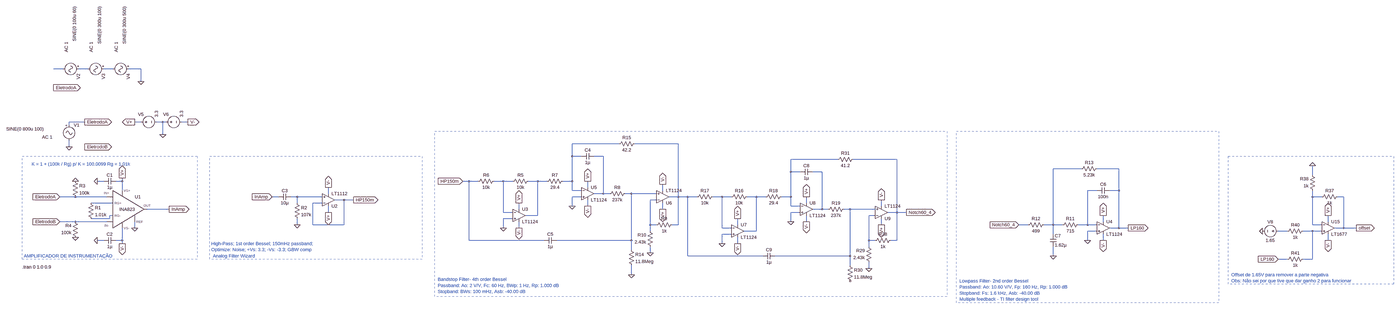
[diagram p0: schematic canal_4th_order.asc, whole sheet]
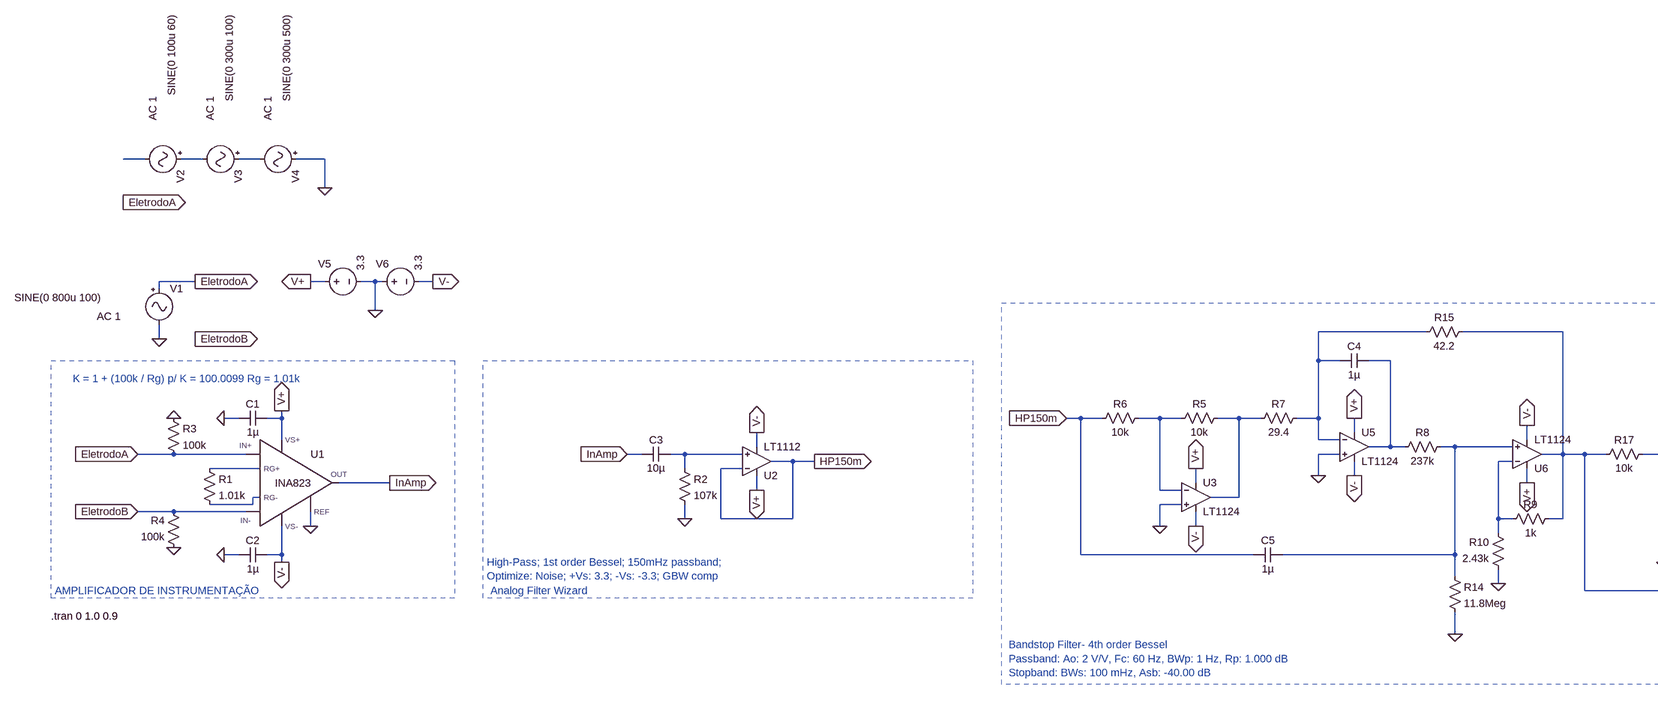
[diagram p1: schematic canal_4th_order.asc, part, row 1 of 1, column 1 of 2]
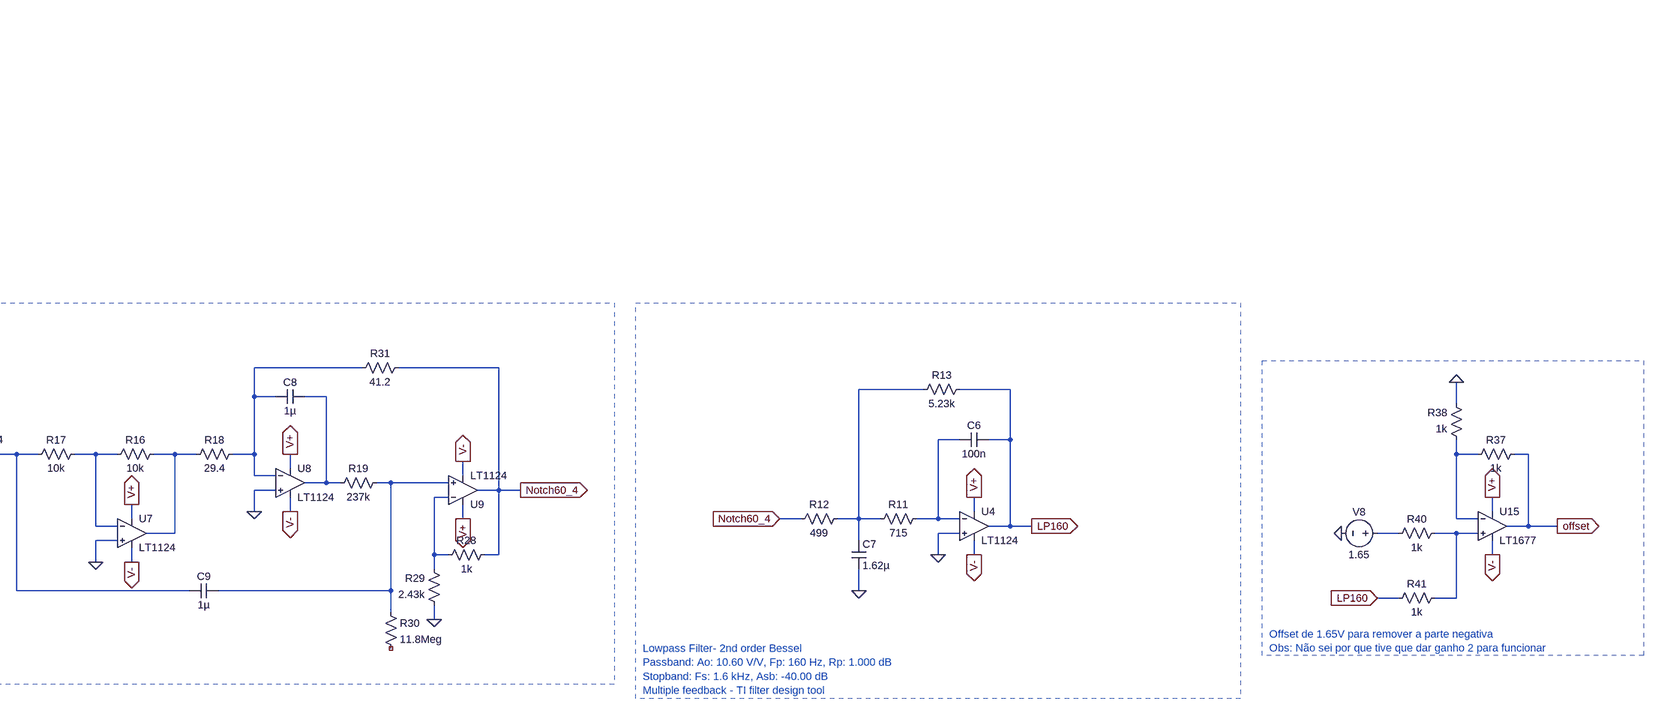
[diagram p2: schematic canal_4th_order.asc, part, row 1 of 1, column 2 of 2]
canal_4th_order.asc, the LTspice schematic file:
Version 4
SHEET 1 6804 2324
WIRE -688 -592 -736 -592
WIRE -560 -592 -608 -592
WIRE -432 -592 -480 -592
WIRE -288 -592 -352 -592
WIRE -288 -528 -288 -592
WIRE -576 -320 -656 -320
WIRE -288 -320 -320 -320
WIRE -176 -320 -208 -320
WIRE -160 -320 -176 -320
WIRE -48 -320 -80 -320
WIRE -656 -304 -656 -320
WIRE -176 -256 -176 -320
WIRE 2160 -208 1920 -208
WIRE 2464 -208 2240 -208
WIRE -656 -192 -656 -224
WIRE 1920 -144 1920 -208
WIRE 1968 -144 1920 -144
WIRE 2080 -144 2032 -144
WIRE 3280 -128 3040 -128
WIRE 3584 -128 3360 -128
WIRE 4528 -80 4384 -80
WIRE 4720 -80 4608 -80
WIRE 3040 -64 3040 -128
WIRE 3088 -64 3040 -64
WIRE 3200 -64 3152 -64
WIRE 5712 -48 5712 -96
WIRE -480 -16 -512 -16
WIRE -384 -16 -384 -32
WIRE -384 -16 -416 -16
WIRE 1392 -16 1360 -16
WIRE 1440 -16 1392 -16
WIRE 1568 -16 1520 -16
WIRE 1616 -16 1568 -16
WIRE 1744 -16 1696 -16
WIRE 1792 -16 1744 -16
WIRE 1920 -16 1920 -144
WIRE 1920 -16 1872 -16
WIRE 2000 16 2000 -16
WIRE -384 32 -384 -16
WIRE 1920 32 1920 -16
WIRE 1968 32 1920 32
WIRE 2384 32 2384 0
WIRE 4608 32 4560 32
WIRE 4720 32 4720 -80
WIRE 4720 32 4672 32
WIRE 672 48 672 16
WIRE 2080 48 2080 -144
WIRE 2080 48 2032 48
WIRE 2112 48 2080 48
WIRE 2224 48 2192 48
WIRE 2352 48 2224 48
WIRE -624 64 -704 64
WIRE -464 64 -624 64
WIRE 416 64 384 64
WIRE 512 64 480 64
WIRE 640 64 512 64
WIRE 1968 64 1920 64
WIRE 2464 64 2464 -208
WIRE 2464 64 2416 64
WIRE 2512 64 2464 64
WIRE 2560 64 2512 64
WIRE 2688 64 2640 64
WIRE 2736 64 2688 64
WIRE 2864 64 2816 64
WIRE 2912 64 2864 64
WIRE 3040 64 3040 -64
WIRE 3040 64 2992 64
WIRE 5712 64 5712 32
WIRE 5760 64 5712 64
WIRE 5872 64 5840 64
WIRE 752 80 704 80
WIRE 800 80 752 80
WIRE 2352 80 2320 80
WIRE -432 96 -544 96
WIRE 512 96 512 64
WIRE 640 96 592 96
WIRE 3120 96 3120 64
WIRE 1920 112 1920 64
WIRE 2000 112 2000 80
WIRE 3040 112 3040 64
WIRE 3088 112 3040 112
WIRE 3504 112 3504 80
WIRE -144 128 -256 128
WIRE 1648 128 1648 96
WIRE 2384 128 2384 96
WIRE 3200 128 3200 -64
WIRE 3200 128 3152 128
WIRE 3232 128 3200 128
WIRE 3344 128 3312 128
WIRE 3472 128 3344 128
WIRE 672 144 672 112
WIRE 1568 144 1568 -16
WIRE 1616 144 1568 144
WIRE 3088 144 3040 144
WIRE 3584 144 3584 -128
WIRE 3584 144 3536 144
WIRE 3632 144 3584 144
WIRE -432 160 -448 160
WIRE 1744 160 1744 -16
WIRE 1744 160 1680 160
WIRE 3472 160 3440 160
WIRE -448 176 -448 160
WIRE -448 176 -544 176
WIRE 1616 176 1568 176
WIRE -624 192 -704 192
WIRE -464 192 -624 192
WIRE 3040 192 3040 144
WIRE 3120 192 3120 160
WIRE 4640 192 4640 160
WIRE 5792 192 5792 160
WIRE 512 208 512 176
WIRE 592 208 592 96
WIRE 752 208 752 80
WIRE 752 208 592 208
WIRE 2320 208 2320 80
WIRE 2352 208 2320 208
WIRE 2464 208 2464 64
WIRE 2464 208 2432 208
WIRE 2768 208 2768 176
WIRE 3504 208 3504 176
WIRE 4256 208 4208 208
WIRE 4384 208 4384 -80
WIRE 4384 208 4336 208
WIRE 4432 208 4384 208
WIRE 4560 208 4560 32
WIRE 4560 208 4512 208
WIRE 4608 208 4560 208
WIRE 5712 208 5712 64
WIRE 5760 208 5712 208
WIRE -320 224 -320 192
WIRE 1568 224 1568 176
WIRE 1648 224 1648 192
WIRE 2688 224 2688 64
WIRE 2736 224 2688 224
WIRE 4720 224 4720 32
WIRE 4720 224 4672 224
WIRE 4768 224 4720 224
WIRE 5872 224 5872 64
WIRE 5872 224 5824 224
WIRE 5936 224 5872 224
WIRE 2320 240 2320 208
WIRE 2864 240 2864 64
WIRE 2864 240 2800 240
WIRE 4608 240 4560 240
WIRE 5584 240 5536 240
WIRE 5712 240 5664 240
WIRE 5760 240 5712 240
WIRE 2736 256 2688 256
WIRE 4384 256 4384 208
WIRE -480 288 -512 288
WIRE -384 288 -384 224
WIRE -384 288 -416 288
WIRE 1392 288 1392 -16
WIRE 1776 288 1392 288
WIRE 2224 288 2224 48
WIRE 2224 288 1840 288
WIRE 3440 288 3440 160
WIRE 3472 288 3440 288
WIRE 3584 288 3584 144
WIRE 3584 288 3552 288
WIRE 4560 288 4560 240
WIRE 4640 288 4640 256
WIRE 5792 288 5792 256
WIRE -384 304 -384 288
WIRE 2688 304 2688 256
WIRE 2768 304 2768 272
WIRE 3440 320 3440 288
WIRE 2224 336 2224 288
WIRE 2320 352 2320 320
WIRE 2512 368 2512 64
WIRE 2896 368 2512 368
WIRE 3344 368 3344 128
WIRE 3344 368 2960 368
WIRE 4384 368 4384 320
WIRE 5584 384 5536 384
WIRE 5712 384 5712 240
WIRE 5712 384 5664 384
WIRE 3344 416 3344 368
WIRE 3440 432 3440 400
WIRE 2224 464 2224 416
FLAG -624 -16 0
FLAG -624 272 0
FLAG -576 -192 EletrodoB
IOPIN -576 -192 Out
FLAG -704 64 EletrodoA
IOPIN -704 64 In
FLAG -704 192 EletrodoB
IOPIN -704 192 In
FLAG -144 128 InAmp
IOPIN -144 128 Out
FLAG -176 -256 0
FLAG -320 -320 V+
IOPIN -320 -320 Out
FLAG -48 -320 V-
IOPIN -48 -320 Out
FLAG -384 304 V-
IOPIN -384 304 Out
FLAG -384 -32 V+
IOPIN -384 -32 Out
FLAG -320 224 0
FLAG -512 -16 0
FLAG -512 288 0
FLAG -656 -192 0
FLAG 672 144 V+
IOPIN 672 144 Out
FLAG 672 16 V-
IOPIN 672 16 Out
FLAG 512 208 0
FLAG 384 64 InAmp
IOPIN 384 64 In
FLAG 800 80 HP150m
IOPIN 800 80 Out
FLAG -576 -320 EletrodoA
IOPIN -576 -320 Out
FLAG 4640 160 V+
IOPIN 4640 160 Out
FLAG 4640 288 V-
IOPIN 4640 288 Out
FLAG 4384 368 0
FLAG 4208 208 Notch60_4
IOPIN 4208 208 In
FLAG 4560 288 0
FLAG 4768 224 LP160
IOPIN 4768 224 Out
FLAG -288 -528 0
FLAG -736 -496 EletrodoA
IOPIN -736 -496 Out
FLAG 1568 224 0
FLAG 1648 96 V+
IOPIN 1648 96 Out
FLAG 1648 224 V-
IOPIN 1648 224 Out
FLAG 2000 -16 V+
IOPIN 2000 -16 Out
FLAG 2000 112 V-
IOPIN 2000 112 Out
FLAG 1920 112 0
FLAG 2384 128 V+
IOPIN 2384 128 Out
FLAG 2384 0 V-
IOPIN 2384 0 Out
FLAG 2320 352 0
FLAG 2224 464 0
FLAG 1360 -16 HP150m
IOPIN 1360 -16 In
FLAG 2688 304 0
FLAG 2768 176 V+
IOPIN 2768 176 Out
FLAG 2768 304 V-
IOPIN 2768 304 Out
FLAG 3120 64 V+
IOPIN 3120 64 Out
FLAG 3120 192 V-
IOPIN 3120 192 Out
FLAG 3040 192 0
FLAG 3504 208 V+
IOPIN 3504 208 Out
FLAG 3504 80 V-
IOPIN 3504 80 Out
FLAG 3440 432 0
FLAG 3632 144 Notch60_4
IOPIN 3632 144 Out
FLAG 5792 288 V-
IOPIN 5792 288 Out
FLAG 5792 160 V+
IOPIN 5792 160 Out
FLAG 5456 240 0
FLAG 5536 384 LP160
IOPIN 5536 384 In
FLAG 5712 -96 0
FLAG 5936 224 offset
IOPIN 5936 224 Out
SYMBOL INA823 -368 128 R0
SYMATTR InstName U1
SYMBOL res -640 -32 R0
SYMATTR InstName R3
SYMATTR Value 100k
SYMBOL res -608 288 R180
WINDOW 0 36 76 Left 2
WINDOW 3 36 40 Left 2
SYMATTR InstName R4
SYMATTR Value 100k
SYMBOL voltage -304 -320 R270
WINDOW 123 0 0 Left 0
WINDOW 39 0 0 Left 0
WINDOW 0 39 1 VRight 2
SYMATTR InstName V5
SYMATTR Value 3.3
SYMBOL voltage -176 -320 R270
WINDOW 123 0 0 Left 0
WINDOW 39 0 0 Left 0
WINDOW 0 39 1 VRight 2
SYMATTR InstName V6
SYMATTR Value 3.3
SYMBOL cap -416 -32 R90
WINDOW 0 0 32 VBottom 2
WINDOW 3 32 32 VTop 2
SYMATTR InstName C1
SYMATTR Value 1µ
SYMBOL cap -416 272 R90
WINDOW 0 0 32 VBottom 2
WINDOW 3 32 32 VTop 2
SYMATTR InstName C2
SYMATTR Value 1µ
SYMBOL res -560 80 R0
SYMATTR InstName R1
SYMATTR Value 1.01k
SYMBOL Misc\\signal -656 -320 R0
WINDOW 3 -322 36 Left 2
WINDOW 123 -139 78 Left 2
WINDOW 39 0 0 Left 0
SYMATTR Value SINE(0 800u 100)
SYMATTR Value2 AC 1
SYMATTR InstName V1
SYMBOL OpAmps\\LT1112 672 144 M180
SYMATTR InstName U2
SYMBOL res 496 80 R0
SYMATTR InstName R2
SYMATTR Value 107k
SYMBOL cap 480 48 R90
WINDOW 0 0 32 VBottom 2
WINDOW 3 32 32 VTop 2
SYMATTR InstName C3
SYMATTR Value 10µ
SYMBOL OpAmps\\LT1124 4640 160 R0
SYMATTR InstName U4
SYMBOL cap 4672 16 R90
WINDOW 0 0 32 VBottom 2
WINDOW 3 32 32 VTop 2
SYMATTR InstName C6
SYMATTR Value 100n
SYMBOL res 4528 192 R90
WINDOW 0 0 56 VBottom 2
WINDOW 3 32 56 VTop 2
SYMATTR InstName R11
SYMATTR Value 715
SYMBOL cap 4368 256 R0
SYMATTR InstName C7
SYMATTR Value 1.62µ
SYMBOL res 4352 192 R90
WINDOW 0 0 56 VBottom 2
WINDOW 3 32 56 VTop 2
SYMATTR InstName R12
SYMATTR Value 499
SYMBOL res 4624 -96 R90
WINDOW 0 0 56 VBottom 2
WINDOW 3 32 56 VTop 2
SYMATTR InstName R13
SYMATTR Value 5.23k
SYMBOL Misc\\signal -592 -592 R90
WINDOW 3 -322 36 Left 2
WINDOW 123 -139 78 Left 2
WINDOW 39 0 0 Left 0
SYMATTR Value SINE(0 100u 60)
SYMATTR Value2 AC 1
SYMATTR InstName V2
SYMBOL Misc\\signal -464 -592 R90
WINDOW 3 -322 36 Left 2
WINDOW 123 -139 78 Left 2
WINDOW 39 0 0 Left 0
SYMATTR Value SINE(0 300u 100)
SYMATTR Value2 AC 1
SYMATTR InstName V3
SYMBOL Misc\\signal -336 -592 R90
WINDOW 3 -322 36 Left 2
WINDOW 123 -139 78 Left 2
WINDOW 39 0 0 Left 0
SYMATTR Value SINE(0 300u 500)
SYMATTR Value2 AC 1
SYMATTR InstName V4
SYMBOL res 1712 -32 R90
WINDOW 0 0 56 VBottom 2
WINDOW 3 32 56 VTop 2
SYMATTR InstName R5
SYMATTR Value 10k
SYMBOL res 1536 -32 R90
WINDOW 0 0 56 VBottom 2
WINDOW 3 32 56 VTop 2
SYMATTR InstName R6
SYMATTR Value 10k
SYMBOL OpAmps\\LT1124 1648 96 R0
SYMATTR InstName U3
SYMBOL res 1888 -32 R90
WINDOW 0 0 56 VBottom 2
WINDOW 3 32 56 VTop 2
SYMATTR InstName R7
SYMATTR Value 29.4
SYMBOL OpAmps\\LT1124 2000 -16 R0
SYMATTR InstName U5
SYMBOL cap 2032 -160 R90
WINDOW 0 0 32 VBottom 2
WINDOW 3 32 32 VTop 2
SYMATTR InstName C4
SYMATTR Value 1µ
SYMBOL res 2208 32 R90
WINDOW 0 0 56 VBottom 2
WINDOW 3 32 56 VTop 2
SYMATTR InstName R8
SYMATTR Value 237k
SYMBOL cap 1840 272 R90
WINDOW 0 0 32 VBottom 2
WINDOW 3 32 32 VTop 2
SYMATTR InstName C5
SYMATTR Value 1µ
SYMBOL OpAmps\\LT1124 2384 128 M180
SYMATTR InstName U6
SYMBOL res 2448 192 R90
WINDOW 0 0 56 VBottom 2
WINDOW 3 32 56 VTop 2
SYMATTR InstName R9
SYMATTR Value 1k
SYMBOL res 2336 336 R180
WINDOW 0 36 76 Left 2
WINDOW 3 36 40 Left 2
SYMATTR InstName R10
SYMATTR Value 2.43k
SYMBOL res 2208 320 R0
SYMATTR InstName R14
SYMATTR Value 11.8Meg
SYMBOL res 2256 -224 R90
WINDOW 0 0 56 VBottom 2
WINDOW 3 32 56 VTop 2
SYMATTR InstName R15
SYMATTR Value 42.2
SYMBOL res 2832 48 R90
WINDOW 0 0 56 VBottom 2
WINDOW 3 32 56 VTop 2
SYMATTR InstName R16
SYMATTR Value 10k
SYMBOL res 2656 48 R90
WINDOW 0 0 56 VBottom 2
WINDOW 3 32 56 VTop 2
SYMATTR InstName R17
SYMATTR Value 10k
SYMBOL OpAmps\\LT1124 2768 176 R0
SYMATTR InstName U7
SYMBOL res 3008 48 R90
WINDOW 0 0 56 VBottom 2
WINDOW 3 32 56 VTop 2
SYMATTR InstName R18
SYMATTR Value 29.4
SYMBOL OpAmps\\LT1124 3120 64 R0
SYMATTR InstName U8
SYMBOL cap 3152 -80 R90
WINDOW 0 0 32 VBottom 2
WINDOW 3 32 32 VTop 2
SYMATTR InstName C8
SYMATTR Value 1µ
SYMBOL res 3328 112 R90
WINDOW 0 0 56 VBottom 2
WINDOW 3 32 56 VTop 2
SYMATTR InstName R19
SYMATTR Value 237k
SYMBOL cap 2960 352 R90
WINDOW 0 0 32 VBottom 2
WINDOW 3 32 32 VTop 2
SYMATTR InstName C9
SYMATTR Value 1µ
SYMBOL OpAmps\\LT1124 3504 208 M180
SYMATTR InstName U9
SYMBOL res 3568 272 R90
WINDOW 0 0 56 VBottom 2
WINDOW 3 32 56 VTop 2
SYMATTR InstName R28
SYMATTR Value 1k
SYMBOL res 3456 416 R180
WINDOW 0 36 76 Left 2
WINDOW 3 36 40 Left 2
SYMATTR InstName R29
SYMATTR Value 2.43k
SYMBOL res 3328 400 R0
SYMATTR InstName R30
SYMATTR Value 11.8Meg
SYMBOL res 3376 -144 R90
WINDOW 0 0 56 VBottom 2
WINDOW 3 32 56 VTop 2
SYMATTR InstName R31
SYMATTR Value 41.2
SYMBOL OpAmps\\LT1677 5792 160 R0
SYMATTR InstName U15
SYMBOL res 5680 224 R90
WINDOW 0 0 56 VBottom 2
WINDOW 3 32 56 VTop 2
SYMATTR InstName R40
SYMATTR Value 1k
SYMBOL res 5680 368 R90
WINDOW 0 0 56 VBottom 2
WINDOW 3 32 56 VTop 2
SYMATTR InstName R41
SYMATTR Value 1k
SYMBOL voltage 5552 240 R90
WINDOW 0 -32 56 VBottom 2
WINDOW 3 32 56 VTop 2
WINDOW 123 0 0 Left 0
WINDOW 39 0 0 Left 0
SYMATTR InstName V8
SYMATTR Value 1.65
SYMBOL res 5856 48 R90
WINDOW 0 0 56 VBottom 2
WINDOW 3 32 56 VTop 2
SYMATTR InstName R37
SYMATTR Value 1k
SYMBOL res 5728 48 R180
WINDOW 0 36 76 Left 2
WINDOW 3 36 40 Left 2
SYMATTR InstName R38
SYMATTR Value 1k
TEXT -848 -104 Left 2 ;K = 1 + (100k / Rg) p/ K = 100.0099 Rg = 1.01k
TEXT -888 368 Left 2 ;AMPLIFICADOR DE INSTRUMENTAÇÃO
TEXT -896 424 Left 2 !.tran 0 1.0 0.9
TEXT 72 304 Left 2 ;High-Pass; 1st order Bessel; 150mHz passband; \nOptimize: Noise; +Vs: 3.3; -Vs: -3.3; GBW comp
TEXT 80 368 Left 2 ;Analog Filter Wizard
TEXT 3904 496 Left 2 ;Lowpass Filter- 2nd order Bessel\nPassband: Ao: 10.60 V/V, Fp: 160 Hz, Rp: 1.000 dB\nStopband: Fs: 1.6 kHz, Asb: -40.00 dB\nMultiple feedback - TI filter design tool
TEXT 1232 488 Left 2 ;Bandstop Filter- 4th order Bessel\nPassband: Ao: 2 V/V, Fc: 60 Hz, BWp: 1 Hz, Rp: 1.000 dB\nStopband: BWs: 100 mHz, Asb: -40.00 dB
TEXT 5296 464 Left 2 ;Offset de 1.65V para remover a parte negativa\nObs: Não sei por que tive que dar ganho 2 para funcionar
RECTANGLE Normal 0 384 -896 -144 2
RECTANGLE Normal 1152 384 64 -144 2
RECTANGLE Normal 5232 608 3888 -272 2
RECTANGLE Normal 3840 576 1216 -272 2
RECTANGLE Normal 6128 512 5280 -144 2

The netlist it stands for:
* canal_4th_order.asc
XU1 EletrodoA EletrodoB V+ V- InAmp 0 N019 N021 INA823  ; pins IN+ IN- VS+ VS- OUT REF RG+ RG-
R3 0 EletrodoA 100k
R4 0 EletrodoB 100k
V5 V+ 0 3.3
V6 0 V- 3.3
C1 V+ 0 1µ
C2 V- 0 1µ
R1 N019 N021 1.01k
V1 EletrodoA 0 SINE(0 800u 100) AC 1
XU2 N014 HP150m V+ V- HP150m LT1112  ; pins In+ In- V+ V- OUT
R2 N014 0 107k
C3 N014 InAmp 10µ
XU4 0 N012 V+ V- LP160 LT1124  ; pins In+ In- V+ V- OUT
C6 LP160 N012 100n
R11 N012 N008 715
C7 N008 0 1.62µ
R12 N008 Notch60_4 499
R13 LP160 N008 5.23k
V2 N002 N001 SINE(0 100u 60) AC 1
V3 N003 N002 SINE(0 300u 100) AC 1
V4 0 N003 SINE(0 300u 500) AC 1
R5 N011 N010 10k
R6 N010 HP150m 10k
XU3 0 N010 V+ V- N011 LT1124  ; pins In+ In- V+ V- OUT
R7 N004 N011 29.4
XU5 0 N004 V+ V- N006 LT1124  ; pins In+ In- V+ V- OUT
C4 N006 N004 1µ
R8 N013 N006 237k
C5 N013 HP150m 1µ
XU6 N013 N018 V+ V- N005 LT1124  ; pins In+ In- V+ V- OUT
R9 N005 N018 1k
R10 0 N018 2.43k
R14 N013 0 11.8Meg
R15 N005 N004 42.2
R16 N016 N015 10k
R17 N015 N005 10k
XU7 0 N015 V+ V- N016 LT1124  ; pins In+ In- V+ V- OUT
R18 N007 N016 29.4
XU8 0 N007 V+ V- N009 LT1124  ; pins In+ In- V+ V- OUT
C8 N009 N007 1µ
R19 N020 N009 237k
C9 N020 N005 1µ
XU9 N020 N022 V+ V- Notch60_4 LT1124  ; pins In+ In- V+ V- OUT
R28 Notch60_4 N022 1k
R29 0 N022 2.43k
R30 N020 NC_01 11.8Meg
R31 Notch60_4 N007 41.2
XU15 N024 N017 V+ V- offset LT1677  ; pins In+ In- V+ V- OUT
R40 N024 N023 1k
R41 N024 LP160 1k
V8 N023 0 1.65
R37 offset N017 1k
R38 N017 0 1k
* K = 1 + (100k / Rg) p/ K = 100.0099 Rg = 1.01k
* AMPLIFICADOR DE INSTRUMENTAÇÃO
.tran 0 1.0 0.9
* High-Pass; 1st order Bessel; 150mHz passband;
* Optimize: Noise; +Vs: 3.3; -Vs: -3.3; GBW comp
* Analog Filter Wizard
* Lowpass Filter- 2nd order Bessel
* Passband: Ao: 10.60 V/V, Fp: 160 Hz, Rp: 1.000 dB
* Stopband: Fs: 1.6 kHz, Asb: -40.00 dB
* Multiple feedback - TI filter design tool
* Bandstop Filter- 4th order Bessel
* Passband: Ao: 2 V/V, Fc: 60 Hz, BWp: 1 Hz, Rp: 1.000 dB
* Stopband: BWs: 100 mHz, Asb: -40.00 dB
* Offset de 1.65V para remover a parte negativa
* Obs: Não sei por que tive que dar ganho 2 para funcionar
.lib Z:\mnt\9a3f66c9-6d6d-4e50-b992-ca8f034e1022\Download\EEG\canal\INA823.LIB
.lib LTC.lib
.backanno
.end